# Altium schematic sheet PWR.SchDoc (part 3 of 3)
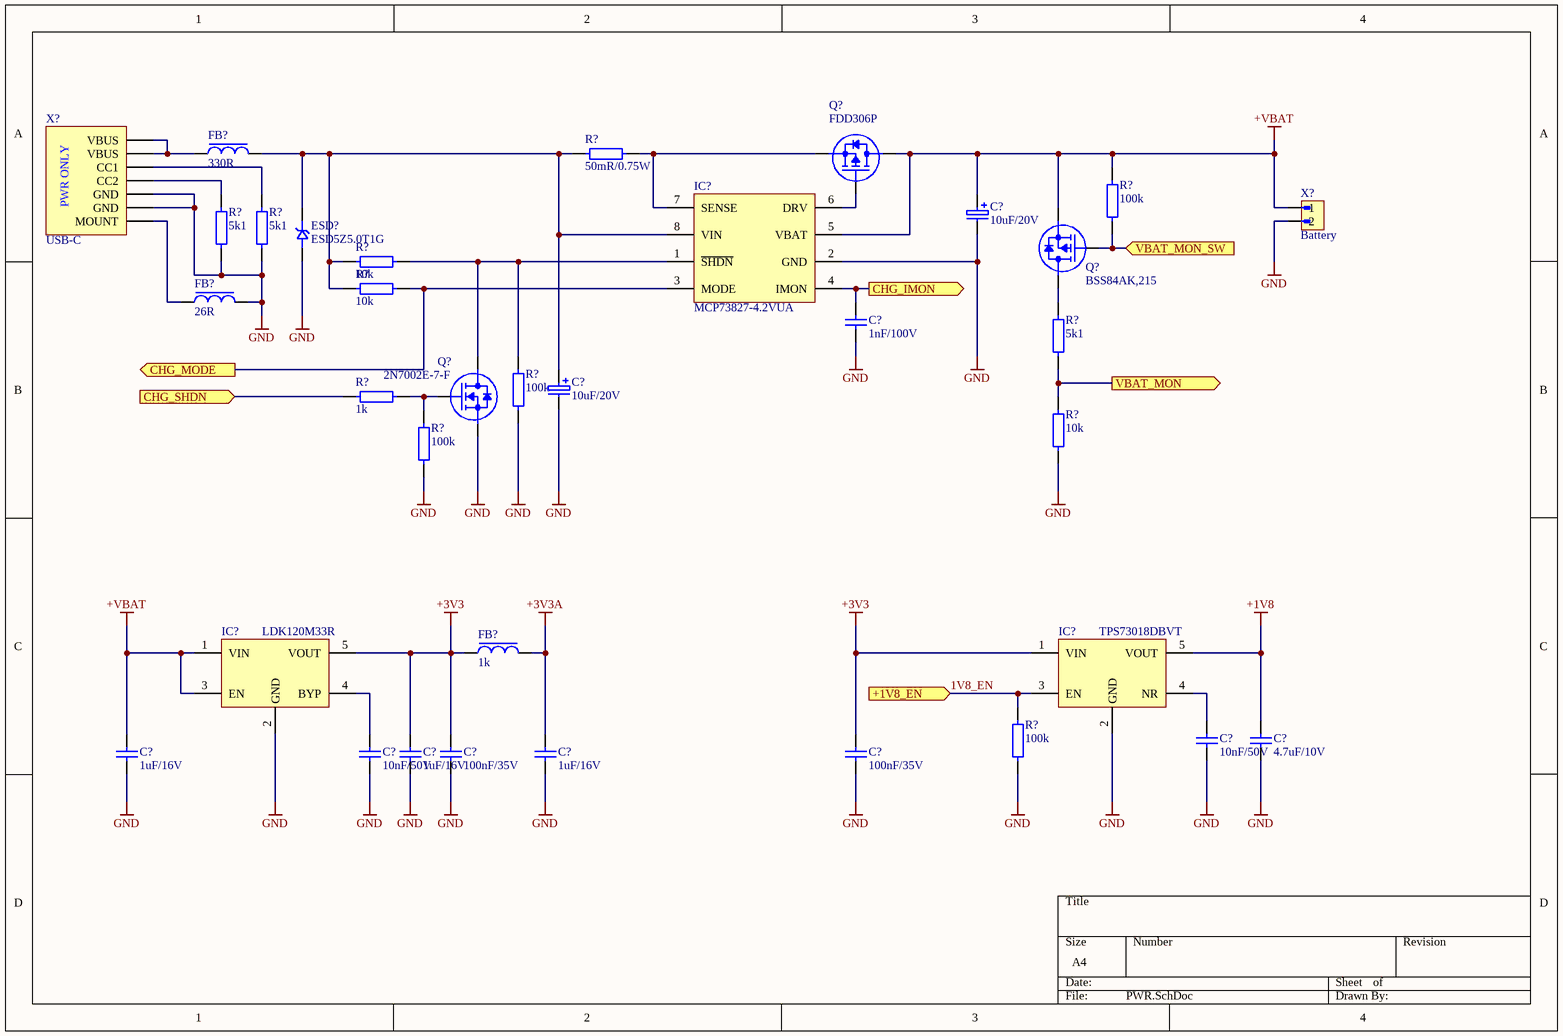
[diagram p2: PWR.SchDoc]

## Library data of the parts (continued)
R?#8 = CR0603-FX-1001ELF: BOURNS - CR0603-FX-1001ELF - SMD Chip Resistor, 0603 [1608 Metric], 1 kohm, CR Series, 50 V, Thick Film, 100 mW; Manufacturer Series: CR0603; Resistance: 1kR; Tolerance: 1%; Temperature Coefficient: 100ppm/°C; Power Rating: 100mW; Voltage Rating: 50V; Manufacturer: Bourns; Manufacturer Part Number: CR0603-FX-1001ELF; RoHS: Yes; Category: Chip SMD Resistors; Stock 1: 461544; Pricing 1: 1=0,10000, 10=0,01700, 100=0,00680, 1000=0,00305, 2500=0,00264 (USD); Mount: Surface Mount; Case/Package: 0603; Number of Pins: 2; Contact Plating: Tin; Case Code (Metric): 1608; Case Code (Imperial): 0603; Package Shape: Rectangular; Size Code: 0603; Terminal Finish: Tin; Min Operating Temperature: -55°C; Max Operating Temperature: 155°C; Resistor Type: Thick Film; Packaging: Tape and Reel; Package Quantity: 1; Number of Terminations: 2; Termination: SMD/SMT; Max Power Dissipation: 100mW; Voltage Rating (DC): 50V; Features: Moisture Resistant; Series: CR0603; Resistance Tolerance: 1%; Technology: THICK FILM; Construction: Rectangular; Working Voltage: 50V; Length: 1.6mm; Width: 0.8mm; Height: 0.45mm; Depth: 0.8mm; Thickness: 457um; Radiation Hardening: No; REACH SVHC: No SVHC; Military Standard: Not; RoHS Compliant: Yes; ComponentLink1URL: https://datasheet.ciiva.com/11808/0900766b80fcdb72-11808035.pdf?src-supplier=RSComponents; ComponentLink1Description: https://datasheet.ciiva.com/11808/0900766b80fcdb72-11808035.pdf?src-supplier=RSComponents; ComponentLink2URL: https://datasheet.ciiva.com/19466/774882-19466523.pdf?src-supplier=Jameco; ComponentLink2Description: https://datasheet.ciiva.com/19466/774882-19466523.pdf?src-supplier=Jameco; ComponentLink3URL: https://datasheet.ciiva.com/6547/chpreztr-6547349.pdf?src-supplier=Digi-Key; ComponentLink3Description: https://datasheet.ciiva.com/6547/chpreztr-6547349.pdf?src-supplier=Digi-Key; ComponentLink4URL: https://datasheet.ciiva.com/16941/chpreztr-16941637.pdf?src-supplier=Avnet+Europe; ComponentLink4Description: https://datasheet.ciiva.com/16941/chpreztr-16941637.pdf?src-supplier=Avnet+Europe; ComponentLink5URL: https://datasheet.ciiva.com/22693/1902866-22693205.pdf?src-supplier=Element14; ComponentLink5Description: https://datasheet.ciiva.com/22693/1902866-22693205.pdf?src-supplier=Element14; ComponentLink6URL: https://datasheet.ciiva.com/6547/chpreztr-6547350.pdf?src-supplier=Digi-Key; ComponentLink6Description: https://datasheet.ciiva.com/6547/chpreztr-6547350.pdf?src-supplier=Digi-Key; ComponentLink7URL: https://datasheet.ciiva.com/7001/1902866-7001622.pdf?src-supplier=Newark; ComponentLink7Description: https://datasheet.ciiva.com/7001/1902866-7001622.pdf?src-supplier=Newark; ComponentLink8URL: https://datasheet.ciiva.com/30115/159chpreztr-30115222.pdf?src-supplier=Onlinecomponents.com; ComponentLink8Description: https://datasheet.ciiva.com/30115/159chpreztr-30115222.pdf?src-supplier=Onlinecomponents.com; ComponentLink9URL: https://datasheet.ciiva.com/6547/chpreztr-6547351.pdf?src-supplier=Digi-Key; ComponentLink9Description: https://datasheet.ciiva.com/6547/chpreztr-6547351.pdf?src-supplier=Digi-Key; ComponentLink10URL: https://datasheet.ciiva.com/16757/70154685-16757482.pdf?src-supplier=Allied+Electronics; ComponentLink10Description: https://datasheet.ciiva.com/16757/70154685-16757482.pdf?src-supplier=Allied+Electronics; ComponentLink11URL: https://datasheet.ciiva.com/5546/chpreztr-5546283.pdf?src-supplier=Mouser; ComponentLink11Description: https://datasheet.ciiva.com/5546/chpreztr-5546283.pdf?src-supplier=Mouser; ComponentLink12URL: https://datasheet.ciiva.com/7986/691949-7986156.pdf?src-supplier=Element14; ComponentLink12Description: https://datasheet.ciiva.com/7986/691949-7986156.pdf?src-supplier=Element14; ComponentLink13URL: https://datasheet.ciiva.com/3255/chpreztr-3255917.pdf?src-supplier=Avnet; ComponentLink13Description: https://datasheet.ciiva.com/3255/chpreztr-3255917.pdf?src-supplier=Avnet; Supplier 1: Digi-Key; Supplier 2: Mouser; Supplier 3: Farnell; Supplier Part Number 1: CR0603-FX-1001ELFCT-ND; Supplier Part Number 2: 652-CR0603FX-1001ELF; Supplier Part Number 3: 2691848
X?#1 = KUSBX-SMT-CS-6-BTR: USB Connectors USB TYPE C RCPT SMT 6PIN; Manufacturer: Kycon; Supplier 1: Mouser; Manufacturer Part Number: KUSBX-SMT-CS-6-BTR; RoHS: No; Stock 1: 580; Pricing 1: 1=0,86000, 10=0,68100, 50=0,68100, 100=0,59200, 1000=0,47300, 10000=0,38400 (USD); Supplier 2: Digi-Key; Supplier Part Number 1: 806-KUSBX-SMTCS6-BTR; Supplier Part Number 2: 2092-KUSBX-SMT-CS-6-BCT-ND
X?#2 = B2B-XH-A(LF)(SN): Conn Shrouded Header (4 Sides) HDR 2 POS 2.5mm Solder ST Thru-Hole Box; Manufacturer: JST; Number of Positions: 2; Connector Type: Male Pin; Contact Resistance: 20mR; Max Current Rating: 3A; Max Voltage Rating (AC): 250V; Insulation Resistance: 1GR; Wire/Cable Gauge: 22AWG; Supplier 1: Farnell; Manufacturer Part Number: B2B-XH-A(LF)(SN); RoHS: Yes; Category: FFC / FPC; Pricing 1: 100=0,071800, 1000=0,052000, 2500=0,048300, 5000=0,044500, 10000=0,043400 (GBP); Mount: Through Hole; Contact Plating: Tin,Copper,Lead; Color: Natural; Contact Material: Brass; Housing Material: Polyamide; Housing Color: White; Min Operating Temperature: -25°C; Max Operating Temperature: 85°C; Termination: Solder; Number of Rows: 1; Packaging: Bulk; Fastening Type: Detent; Orientation: Straight; Current Rating: 3A; Voltage Rating: 250V; Voltage Rating (AC): 250V; Number of Contacts: 2; Max Voltage Rating (DC): 250V; Length: 7.4mm; Pitch: 2.5mm; Depth: 5.75mm; Lead Pitch: 2.5mm; Lead Free: Lead Free; REACH SVHC: No SVHC; ComponentLink1URL: https://datasheet.ciiva.com/26894/getdatasheetpartid-640357-26894434.pdf?src-supplier=Verical; ComponentLink1Description: https://datasheet.ciiva.com/26894/getdatasheetpartid-640357-26894434.pdf?src-supplier=Verical; ComponentLink2URL: https://datasheet.ciiva.com/11746/0900766b8082653e-11746979.pdf?src-supplier=RSComponents; ComponentLink2Description: https://datasheet.ciiva.com/11746/0900766b8082653e-11746979.pdf?src-supplier=RSComponents; ComponentLink3URL: https://datasheet.ciiva.com/26894/getdatasheetpartid-385291-26894760.pdf?src-supplier=Verical; ComponentLink3Description: https://datasheet.ciiva.com/26894/getdatasheetpartid-385291-26894760.pdf?src-supplier=Verical; ComponentLink4URL: https://datasheet.ciiva.com/8052/5448-8052024.pdf?src-supplier=Element14; ComponentLink4Description: https://datasheet.ciiva.com/8052/5448-8052024.pdf?src-supplier=Element14; ComponentLink5URL: https://datasheet.ciiva.com/20207/523653-20207167.pdf?src-supplier=Rapid+Electronics; ComponentLink5Description: https://datasheet.ciiva.com/20207/523653-20207167.pdf?src-supplier=Rapid+Electronics; Supplier Part Number 1: 1516276

## Notes on the sheet
- (in symbol KUSBX-SMT-CS-6-BTR) PWR ONLY